# Altium schematic sheet lpGBT-Config.SchDoc: LpGBT Configuration
size A; DocumentNumber: 8; SheetNumber: 8; SheetTotal: 22
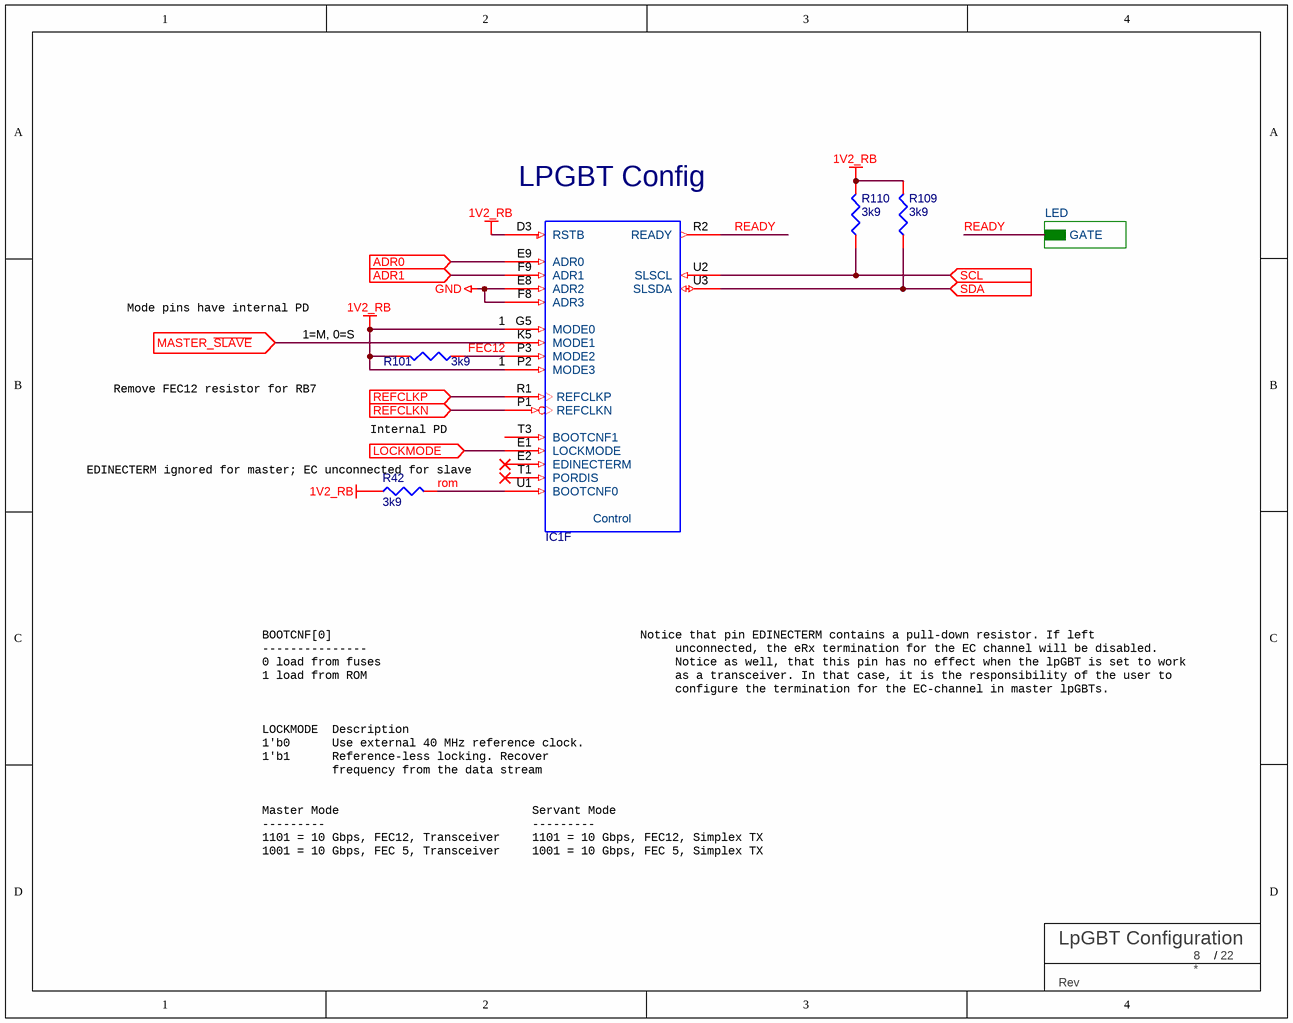
[diagram p0: lpGBT-Config.SchDoc]

## Parts
IC1  LPGBT  [BGA289X17]  (value not drawn)  (part F of 8)
R42  3k9  [R_0402_IPC]
R101  3k9  [R_0402_IPC]
R109  3k9  [R_0402_IPC]
R110  3k9  [R_0402_IPC]
TBLOCK?  BU Title block  (value not drawn)  (graphical)

## Sub-sheets
LED = LED-Driver.SchDoc: GATE

## Ports
ADR0 (in), ADR1 (in), LOCKMODE (in), MASTER_~{SLAVE} (in), REFCLKN (in), REFCLKP (in), SCL (in), SDA (in)

## Nets
1V2_RB: IC1.D3(RSTB) IC1.G5(MODE0) IC1.P2(MODE3) R42.1 R101.2 R109.2 R110.2
GND: IC1.E8(ADR2) IC1.F8(ADR3)
ADR0: IC1.E9(ADR0) ; port ADR0
ADR1: IC1.F9(ADR1) ; port ADR1
FEC12: IC1.P3(MODE2) R101.1
LOCKMODE: IC1.E1(LOCKMODE) ; port LOCKMODE
MASTER_~{SLAVE}: IC1.K5(MODE1) ; port MASTER_~{SLAVE}
READY: IC1.R2(READY) ; sheet LED/GATE
REFCLKN: IC1.P1(REFCLKN) ; port REFCLKN
REFCLKP: IC1.R1(REFCLKP) ; port REFCLKP
rom: IC1.U1(BOOTCNF0) R42.2
SCL: IC1.U2(SLSCL) R110.1 ; port SCL
SDA: IC1.U3(SLSDA) R109.1 ; port SDA

Not connected (* = marked no-connect by the designer): IC1 E2(EDINECTERM)* T1(PORDIS)* T3(BOOTCNF1)

## Notes on the sheet
- (near IC1) LPGBT Config
- Mode pins have internal PD
- 1=M, 0=S
- 1
- Remove FEC12 resistor for RB7
- Internal PD
- (near R42) EDINECTERM ignored for master; EC unconnected for slave
- BOOTCNF[0]
  ---------------
  0 load from fuses
  1 load from ROM
- LOCKMODE  Description
  1'b0      Use external 40 MHz reference clock.
  1'b1      Reference-less locking. Recover
  frequency from the data stream
- Notice that pin EDINECTERM contains a pull-down resistor. If left
  unconnected, the eRx termination for the EC channel will be disabled.
  Notice as well, that this pin has no effect when the lpGBT is set to work
  as a transceiver. In that case, it is the responsibility of the user to
  configure the termination for the EC-channel in master lpGBTs.
- Master Mode
  ---------
  1101 = 10 Gbps, FEC12, Transceiver
  1001 = 10 Gbps, FEC 5, Transceiver
- Servant Mode
  ---------
  1101 = 10 Gbps, FEC12, Simplex TX
  1001 = 10 Gbps, FEC 5, Simplex TX
- (in symbol LPGBT, part F) Control
- (in symbol TITLE_BLOCK_BU) /; Rev

## Library data of the parts
IC1 = LPGBT: Low Power Gigabit Transceiver; Manufacturer: CERN; Pinout Version: 180226; Bonding: No; Device: LPGBT; Manufacturer Part Number: LPGBT; SMD: Yes; Mounted: Yes; LatestRevisionDate: 26.10.2018; PackageDescription: BGA, 289-Leads, Body 9.00x9.00mmx1.28mm, Pitch 0.50mm; Part Description: Low Power Gigabit Transceiver; Case: BGA289; Part Number: LPGBT; Pin Count: 289; Socket: No; Component Kind: Standard; Component Type: Standard; Footprint: BGA289C50P17X17_900X900X128
R42 R101 R109 R110 = R-E3-3K9-0402-5%: RES SMD 3.9K OHM 5% 1/16W 0402
TBLOCK? = TITLE_BLOCK_BU